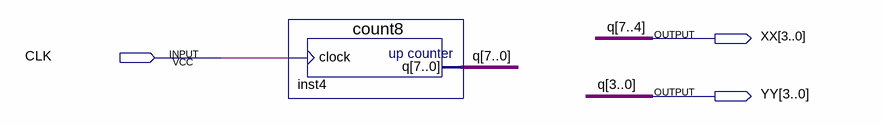
[diagram p0: schematic sheet]
// Quartus schematic counter.bdf as structural Verilog: 1 symbols, 3 pins
module counter (
  input  CLK,
  output [3:0] XX,
  output [3:0] YY
);

  count8 inst4 (.clock(CLK), .q({XX, YY}));

  // Other names for the same wires on the sheet: q[7:0] = {XX, YY}
endmodule
